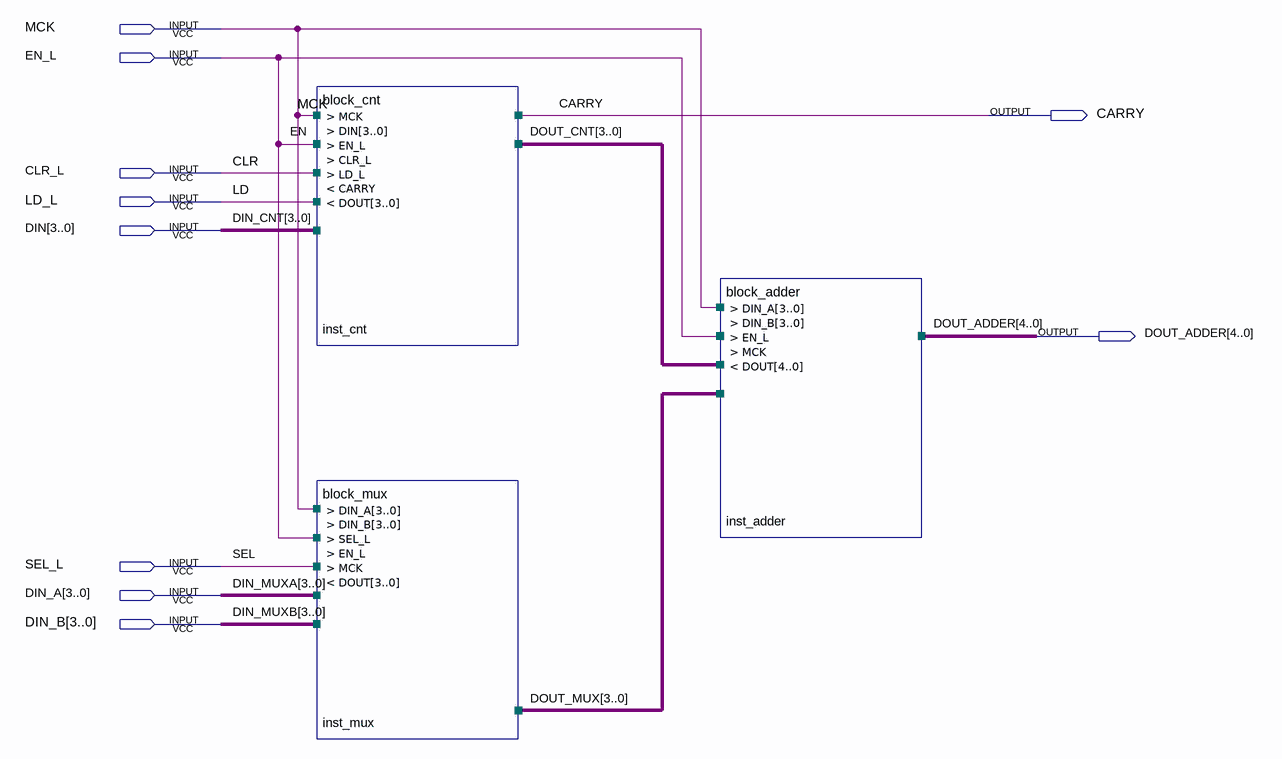
[diagram p0: schematic sheet]
// Quartus schematic PortingTest_TL.bdf as structural Verilog: 3 symbols, 10 pins
module PortingTest_TL (
  input  MCK,
  input  EN_L,
  input  CLR_L,
  input  LD_L,
  input  [3:0] DIN,
  input  SEL_L,
  input  [3:0] DIN_A,
  input  [3:0] DIN_B,
  output CARRY,
  output [4:0] DOUT_ADDER
);

  wire [3:0] DOUT_CNT, DOUT_MUX;

  block_cnt inst_cnt (.MCK(MCK), .DIN(DIN), .EN_L(EN_L), .CLR_L(CLR_L), .LD_L(LD_L), .CARRY(CARRY), .DOUT(DOUT_CNT));
  block_mux inst_mux (.DIN_A(DIN_A), .DIN_B(DIN_B), .SEL_L(SEL_L), .EN_L(EN_L), .MCK(MCK), .DOUT(DOUT_MUX));
  block_adder inst_adder (.DIN_A(DOUT_CNT), .DIN_B(DOUT_MUX), .EN_L(EN_L), .MCK(MCK), .DOUT(DOUT_ADDER));

  // Other names for the same wires on the sheet: CLR = CLR_L; DIN_CNT[3:0] = DIN; DIN_MUXA[3:0] = DIN_A;
  //   DIN_MUXB[3:0] = DIN_B; EN = EN_L; LD = LD_L; SEL = SEL_L
endmodule
